# Altium project IDC_MCX_Adapter.PrjPCB
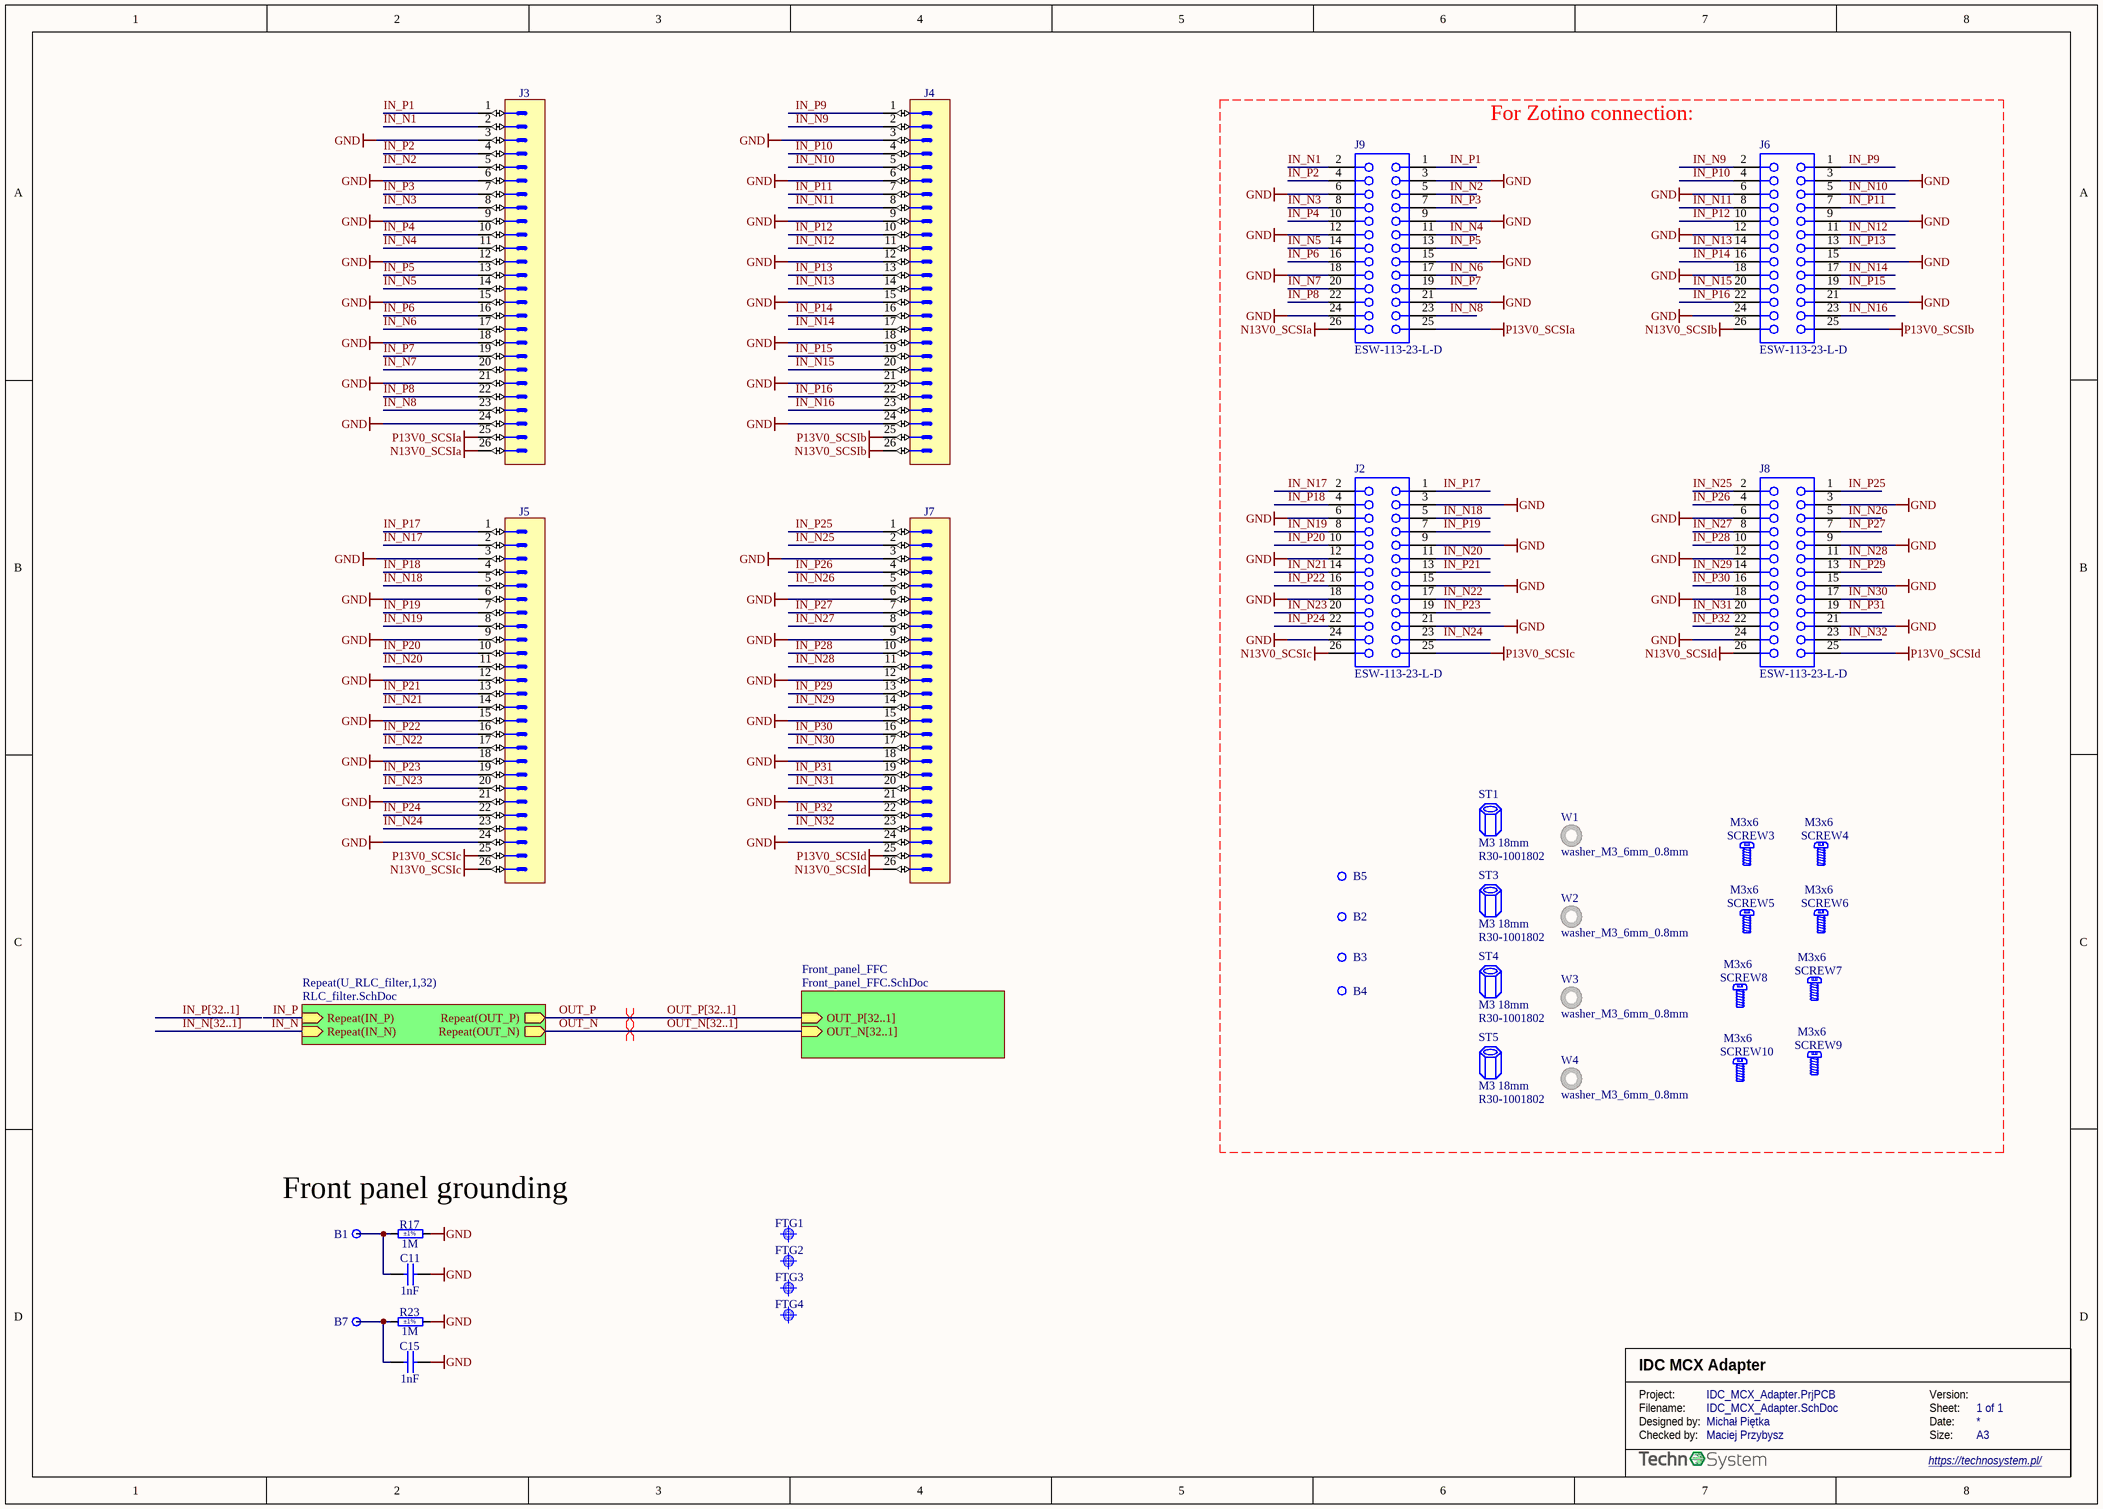
[diagram p0: IDC_MCX_Adapter.SchDoc]
P_version: 2.0
3 sheets, 264 parts. Net scope: hierarchical (ports join the sheet entries above them; power ports are global).
Board file: IDC_MCX_Adapter.PCBDOC
Sheets:
  IDC_MCX_Adapter.SchDoc
    U_RLC_filter1 = RLC_filter.SchDoc
    U_RLC_filter2 = RLC_filter.SchDoc
    U_RLC_filter3 = RLC_filter.SchDoc
    U_RLC_filter4 = RLC_filter.SchDoc
    U_RLC_filter5 = RLC_filter.SchDoc
    U_RLC_filter6 = RLC_filter.SchDoc
    U_RLC_filter7 = RLC_filter.SchDoc
    U_RLC_filter8 = RLC_filter.SchDoc
    U_RLC_filter9 = RLC_filter.SchDoc
    U_RLC_filter10 = RLC_filter.SchDoc
    U_RLC_filter11 = RLC_filter.SchDoc
    U_RLC_filter12 = RLC_filter.SchDoc
    U_RLC_filter13 = RLC_filter.SchDoc
    U_RLC_filter14 = RLC_filter.SchDoc
    U_RLC_filter15 = RLC_filter.SchDoc
    U_RLC_filter16 = RLC_filter.SchDoc
    U_RLC_filter17 = RLC_filter.SchDoc
    U_RLC_filter18 = RLC_filter.SchDoc
    U_RLC_filter19 = RLC_filter.SchDoc
    U_RLC_filter20 = RLC_filter.SchDoc
    U_RLC_filter21 = RLC_filter.SchDoc
    U_RLC_filter22 = RLC_filter.SchDoc
    U_RLC_filter23 = RLC_filter.SchDoc
    U_RLC_filter24 = RLC_filter.SchDoc
    U_RLC_filter25 = RLC_filter.SchDoc
    U_RLC_filter26 = RLC_filter.SchDoc
    U_RLC_filter27 = RLC_filter.SchDoc
    U_RLC_filter28 = RLC_filter.SchDoc
    U_RLC_filter29 = RLC_filter.SchDoc
    U_RLC_filter30 = RLC_filter.SchDoc
    U_RLC_filter31 = RLC_filter.SchDoc
    U_RLC_filter32 = RLC_filter.SchDoc
    Front_panel_FFC = Front_panel_FFC.SchDoc

## Sheet IDC_MCX_Adapter.SchDoc: IDC MCX Adapter
size A3; CheckedBy: Maciej Przybysz; Author: Michał Piętka; Organization: Technosystem; Address1: Słoneczna 125, 05-506 Kolonia Lesznowola; Address2: https://technosystem.pl/; Address4: (NOT USED); DocumentNumber: 1; Revision: 0; SheetNumber: 1; SheetTotal: 1; Version: 2.0

### Parts
B1  Plated Hole  [MTG270_500]  (value not drawn)  (no BOM)
B2  Plated Hole  [MTG320_700]  (value not drawn)  (no BOM)
B3  Plated Hole  [MTG320_700]  (value not drawn)  (no BOM)
B4  Plated Hole  [MTG320_700]  (value not drawn)  (no BOM)
B5  Plated Hole  [MTG320_700]  (value not drawn)  (no BOM)
B7  Plated Hole  [MTG270_500]  (value not drawn)  (no BOM)
C11  1nF  [CAPC1608X87N]
C15  1nF  [CAPC1608X87N]
FTG1  Use only in PCB  [FIDUCIAL_TOP_C100-200]  (value not drawn)
FTG2  Use only in PCB  [FIDUCIAL_TOP_S100-200]  (value not drawn)
FTG3  Use only in PCB  [FIDUCIAL_TOP_S100-200]  (value not drawn)
FTG4  Use only in PCB  [FIDUCIAL_TOP_S100-200]  (value not drawn)
J2  ESW-113-23-L-D  [SMTC-ESW-113-23-X-D]
J3  Header 26  [3M_N2526-6002RB]  (value not drawn)
J4  Header 26  [3M_N2526-6002RB]  (value not drawn)
J5  Header 26  [3M_N2526-6002RB]  (value not drawn)
J6  ESW-113-23-L-D  [SMTC-ESW-113-23-X-D]
J7  Header 26  [3M_N2526-6002RB]  (value not drawn)
J8  ESW-113-23-L-D  [SMTC-ESW-113-23-X-D]
J9  ESW-113-23-L-D  [SMTC-ESW-113-23-X-D]
R17  1M  Tolerance: ±1%  [RESC1608X55N]
R23  1M  Tolerance: ±1%  [RESC1608X55N]
SCREW3  M3x6  [BOSSARD_BN5687-3061605_v]
SCREW4  M3x6  [BOSSARD_BN5687-3061605_v]
SCREW5  M3x6  [BOSSARD_BN5687-3061605_v]
SCREW6  M3x6  [BOSSARD_BN5687-3061605_v]
SCREW7  M3x6  [BOSSARD_BN5687-3061605_v]
SCREW8  M3x6  [BOSSARD_BN5687-3061605_v]
SCREW9  M3x6  [BOSSARD_BN5687-3061605_v]
SCREW10  M3x6  [BOSSARD_BN5687-3061605_v]
ST1  M3 18mm  [R30-1001802]
ST3  M3 18mm  [R30-1001802]
ST4  M3 18mm  [R30-1001802]
ST5  M3 18mm  [R30-1001802]
W1  washer_M3_6mm_0.8mm  [washer_M3_6mm_0.8mm]
W2  washer_M3_6mm_0.8mm  [washer_M3_6mm_0.8mm]
W3  washer_M3_6mm_0.8mm  [washer_M3_6mm_0.8mm]
W4  washer_M3_6mm_0.8mm  [washer_M3_6mm_0.8mm]

### Sub-sheets
Front_panel_FFC = Front_panel_FFC.SchDoc: OUT_P[32..1] (in), OUT_N[32..1] (in)
Repeat(U_RLC_filter,1,32) = RLC_filter.SchDoc: Repeat(IN_P) (in), Repeat(IN_N) (in), Repeat(OUT_P) (out), Repeat(OUT_N) (out)

### Nets
GND: C11.2 C15.2 J2.3 J2.6 J2.9 J2.12 J2.15 J2.18 J2.21 J2.24 J3.3 J3.6 J3.9 J3.12 J3.15 J3.18 J3.21 J3.24 J4.3 J4.6 J4.9 J4.12 J4.15 J4.18 J4.21 J4.24 J5.3 J5.6 J5.9 J5.12 J5.15 J5.18 J5.21 J5.24 J6.3 J6.6 J6.9 J6.12 J6.15 J6.18 J6.21 J6.24 J7.3 J7.6 J7.9 J7.12 J7.15 J7.18 J7.21 J7.24 J8.3 J8.6 J8.9 J8.12 J8.15 J8.18 J8.21 J8.24 J9.3 J9.6 J9.9 J9.12 J9.15 J9.18 J9.21 J9.24 R17.2 R23.2
N13V0_SCSIa: J3.26 J9.26
N13V0_SCSIb: J4.26 J6.26
N13V0_SCSIc: J2.26 J5.26
N13V0_SCSId: J7.26 J8.26
P13V0_SCSIa: J3.25 J9.25
P13V0_SCSIb: J4.25 J6.25
P13V0_SCSIc: J2.25 J5.25
P13V0_SCSId: J7.25 J8.25
IN_N: sheet Repeat(U_RLC_filter,1,32)/Repeat(IN_N)
IN_N1: J3.2 J9.2  [project net IN_N]
IN_N2: J3.5 J9.5  [project net IN_N]
IN_N3: J3.8 J9.8  [project net IN_N]
IN_N4: J3.11 J9.11  [project net IN_N]
IN_N5: J3.14 J9.14  [project net IN_N]
IN_N6: J3.17 J9.17  [project net IN_N]
IN_N7: J3.20 J9.20  [project net IN_N]
IN_N8: J3.23 J9.23  [project net IN_N]
IN_N9: J4.2 J6.2  [project net IN_N]
IN_N10: J4.5 J6.5  [project net IN_N]
IN_N11: J4.8 J6.8  [project net IN_N]
IN_N12: J4.11 J6.11  [project net IN_N]
IN_N13: J4.14 J6.14  [project net IN_N]
IN_N14: J4.17 J6.17  [project net IN_N]
IN_N15: J4.20 J6.20  [project net IN_N]
IN_N16: J4.23 J6.23  [project net IN_N]
IN_N17: J2.2 J5.2  [project net IN_N]
IN_N18: J2.5 J5.5  [project net IN_N]
IN_N19: J2.8 J5.8  [project net IN_N]
IN_N20: J2.11 J5.11  [project net IN_N]
IN_N21: J2.14 J5.14  [project net IN_N]
IN_N22: J2.17 J5.17  [project net IN_N]
IN_N23: J2.20 J5.20  [project net IN_N]
IN_N24: J2.23 J5.23  [project net IN_N]
IN_N25: J7.2 J8.2  [project net IN_N]
IN_N26: J7.5 J8.5  [project net IN_N]
IN_N27: J7.8 J8.8  [project net IN_N]
IN_N28: J7.11 J8.11  [project net IN_N]
IN_N29: J7.14 J8.14  [project net IN_N]
IN_N30: J7.17 J8.17  [project net IN_N]
IN_N31: J7.20 J8.20  [project net IN_N]
IN_N32: J7.23 J8.23  [project net IN_N]
IN_P: sheet Repeat(U_RLC_filter,1,32)/Repeat(IN_P)
IN_P1: J3.1 J9.1  [project net IN_P]
IN_P2: J3.4 J9.4  [project net IN_P]
IN_P3: J3.7 J9.7  [project net IN_P]
IN_P4: J3.10 J9.10  [project net IN_P]
IN_P5: J3.13 J9.13  [project net IN_P]
IN_P6: J3.16 J9.16  [project net IN_P]
IN_P7: J3.19 J9.19  [project net IN_P]
IN_P8: J3.22 J9.22  [project net IN_P]
IN_P9: J4.1 J6.1  [project net IN_P]
IN_P10: J4.4 J6.4  [project net IN_P]
IN_P11: J4.7 J6.7  [project net IN_P]
IN_P12: J4.10 J6.10  [project net IN_P]
IN_P13: J4.13 J6.13  [project net IN_P]
IN_P14: J4.16 J6.16  [project net IN_P]
IN_P15: J4.19 J6.19  [project net IN_P]
IN_P16: J4.22 J6.22  [project net IN_P]
IN_P17: J2.1 J5.1  [project net IN_P]
IN_P18: J2.4 J5.4  [project net IN_P]
IN_P19: J2.7 J5.7  [project net IN_P]
IN_P20: J2.10 J5.10  [project net IN_P]
IN_P21: J2.13 J5.13  [project net IN_P]
IN_P22: J2.16 J5.16  [project net IN_P]
IN_P23: J2.19 J5.19  [project net IN_P]
IN_P24: J2.22 J5.22  [project net IN_P]
IN_P25: J7.1 J8.1  [project net IN_P]
IN_P26: J7.4 J8.4  [project net IN_P]
IN_P27: J7.7 J8.7  [project net IN_P]
IN_P28: J7.10 J8.10  [project net IN_P]
IN_P29: J7.13 J8.13  [project net IN_P]
IN_P30: J7.16 J8.16  [project net IN_P]
IN_P31: J7.19 J8.19  [project net IN_P]
IN_P32: J7.22 J8.22  [project net IN_P]
OUT_N: sheet Repeat(U_RLC_filter,1,32)/Repeat(OUT_N)
OUT_P: sheet Repeat(U_RLC_filter,1,32)/Repeat(OUT_P)
NetB1_1: B1.1 C11.1 R17.1
NetB7_1: B7.1 C15.1 R23.1

Not connected (* = marked no-connect by the designer): B2 1; B3 1; B4 1; B5 1

### Buses and harness runs
bus IN_N[32..1]
bus IN_P[32..1]
bus OUT_N[32..1] = sheet Front_panel_FFC/OUT_N[32..1]
bus OUT_P[32..1] = sheet Front_panel_FFC/OUT_P[32..1]

### Layout directives
differential pair: OUT_N, OUT_P

### Notes on the sheet
- (near J6) For Zotino connection:
- Front panel grounding
- Project:
- Version:
- Designed by:
- Checked by:
- Filename:
- Size:
- Date:
- Sheet:
- A3

### Library data of the parts
B1 B7 = PLATED_HOLE2.7_PAD5.0: Single Terminal Socket; Part Description: Plated Through Hole: Hole Dia.=2.7mm Pad Dia.=5.0mm; Mounted: No; Part Number: PLATED_HOLE2.7_PAD5.0; Component Type: Standard (No BOM); Pin Count: 1; Family: Plated Hole; Socket: No; SMD: No; Sense: No; Status: None; ComponentHeight: 0mm; HelpURL: Undefined; Author: CERN DEM JMW; CreateDate: 27.09.2011; LatestRevisionDate: 27.09.2011; PackageDescription: Plated Through Hole: Hole Dia.=2.7mm Pad Dia.=5.0mm
B2-B5 = PLATED_HOLE3.2_PAD7.0: Single Terminal Socket; Part Description: Plated Through Hole: Hole Dia.=3.2mm Pad Dia.=7.0mm; Mounted: No; Part Number: PLATED_HOLE3.2_PAD7.0; Component Type: Standard (No BOM); Pin Count: 1; Family: Plated Hole; Socket: No; SMD: No; Sense: No; Status: None; ComponentHeight: 0mm; HelpURL: Undefined; Author: CERN DEM JMW; CreateDate: 28.11.2017; LatestRevisionDate: 28.11.2017; PackageDescription: Plated Through Hole: Hole Dia.=3.2mm Pad Dia.=7.0mm
C11 C15 = CC0603_1NF_50V_10%_X7R: Non-polarised capacitor; Part Description: SMD Multilayer Chip Ceramic Capacitor; Manufacturer: GENERIC; Manufacturer1 Part Number: 223858615623; Voltage: 50V; TC: X7R; Tolerance: ±10%; Part Number: CC0603_1NF_50V_10%_X7R; Component Kind: Standard; Component Type: Standard; Pin Count: 2; Value: 1nF; Status: Preferred; Manufacturer Part Number: CC0603_1NF_50V_10%_X7R; Case: 0603; Mounted: Yes; Socket: No; SMD: Yes; Sense: No; Manufacturer1 ComponentHeight: 0.87mm; HelpURL: \\cern.ch\dfs\Applications\Altium\Datasheets\CC0603_X7R_PHYCOMP.pdf; Author: CERN DEM JLC; CreateDate: 03.12.2007; LatestRevisionDate: 03.12.2007; Manufacturer1 Example: PHYCOMP
FTG1 = FIDUCIAL_TARGET_C100-200: Fiducial Target; Part Description: Round Fiducial Target, Top Layer, 1.0mm, Top Solder 2.0mm, Keepout =2.0mm; Mounted: No; Part Number: FIDUCIAL_TARGET_C100-200; Component Kind: Standard (No BOM); Component Type: Standard (No BOM); Pin Count: 1; Family: Fiducial; Socket: No; SMD: Yes; Sense: No; Status: None; ComponentHeight: 0mm; HelpURL: Undefined; Author: CERN DEM JLC; CreateDate: 09.02.2010; LatestRevisionDate: 04.04.2012; PackageDescription: Round Fiducial Target, Top Layer, 1.0mm, Top Solder 2.0mm, Keepout =2.0mm
FTG2-FTG4 = FIDUCIAL_TARGET_S100-200: Fiducial Target; Part Description: Square Fiducial Target, Top Layer, 1.0mm, Top Solder 2.0mm, Keepout =2.0mm; Mounted: No; Part Number: FIDUCIAL_TARGET_S100-200; Component Kind: Standard (No BOM); Component Type: Standard (No BOM); Pin Count: 1; Family: Fiducial; Socket: No; SMD: Yes; Sense: No; Status: None; ComponentHeight: 0mm; HelpURL: Undefined; Author: CERN DEM JLC; CreateDate: 09.02.2010; LatestRevisionDate: 04.04.2012; PackageDescription: Square Fiducial Target, Top Layer, 1.0mm, Top Solder 2.0mm, Keepout =2.0mm
J2 J6 J8 J9 = CMP-1023-00053-1: Elevated Socket, Through-hole, Vertical, -55 to 125 degC, 2.54 mm Pitch, 26-Pin, Female, RoHS; Manufacturer: Samtec; Pitch: 2.54 mm; PartNumber: ESW-113-23-L-D; Orientation: Vertical; PackageReference: ESW-113-23-X-D; ComponentLink3Description: Package Specification; Temperature Range: -55 to 125 degC; PackageDescription: ESW Strip ASM; RoHS: True; ComponentLink1Description: Manufacturer URL; Mounting Technology: Through-hole; ComponentLink2Description: Datasheet; ComponentLink3URL: http://www.samtec.com/documents/webfiles/cpdf/ESW-1XX-XX-X-X-XX-XX-MKT.pdf; PackageVersion: AV, 7/1985; ComponentLink1URL: http://www.samtec.com; ComponentLink2URL: http://www.samtec.com/documents/webfiles/pdf/ESW_TH.PDF; DatasheetVersion: F-214
J3-J5 J7 = 3M_N2526-6002RB: Connector 26 Male; Part Description: 26 Contacts - Straight .100'' x .100'' Low Profile Four-Wall Header, 2500 Series; Manufacturer: 3M; PressFit: No; Part Number: 3M_N2526-6002RB; Component Kind: Standard; Component Type: Standard; Pin Count: 26; Family: Header 26; Mounted: Yes; Socket: No; SMD: No; Sense: No; Status: None; Manufacturer Part Number: N2526-6002RB; ComponentHeight: 10.03mm; HelpURL: \\cern.ch\dfs\Applications\Altium\Datasheets\3M_N2526-6002RB.pdf; Author: CERN DEM JLC; CreateDate: 11.02.2009; LatestRevisionDate: 11.08.2009
R17 R23 = R0603_1M_1%_0.1W_100PPM: Resistor - 1%; Part Description: General Purpose Thick Film Chip Resistor; Manufacturer: GENERIC; Manufacturer1 Part Number: NRC06F1004TRF; PressFit: No; Power: 0.1W; TC: ±100ppm/°C; Part Number: R0603_1M_1%_0.1W_100PPM; Component Kind: Standard; Component Type: Standard; Pin Count: 2; Value: 1M; Status: Preferred; Manufacturer Part Number: R0603_1M_1%_0.1W_100PPM; Case: 0603; Mounted: Yes; Sense: No; Socket: No; SMD: Yes; Manufacturer1 Example: NIC COMPONENT; Manufacturer1 ComponentHeight: 0.55mm; HelpURL: \\cern.ch\dfs\Applications\Altium\Datasheets\R0603_NIC_NRC.pdf; Author: CERN DEM JLC; CreateDate: 03.12.2007; LatestRevisionDate: 13.03.2008
SCREW3-SCREW10 = BOSSARD_BN5687-3061605_v: Screw; Part Description: M3 L=6mm Hexalobular Socket Pan Head Screw, Fully Threaded, Stainless Steel A2; Manufacturer Part Number: BN5687 Art.3061605; PressFit: No; Part Number: BOSSARD_BN5687-3061605_v; Component Kind: Standard; Component Type: Mechanical; Pin Count: 0; PackageDescription: M3 L=6mm Hexalobular Socket Pan Head Screw, Fully Threaded - Stainless Steel A2; Mounted: Yes; Socket: No; SMD: No; Sense: No; Status: None; Value: M3x6; Manufacturer: BOSSARD; ComponentHeight: 2.4mm; HelpURL: \\cern.ch\dfs\Applications\Altium\Datasheets\BOSSARD_BN5687-3061605.pdf; Author: CERN DEM JLC; CreateDate: 15.01.2013; LatestRevisionDate: 15.01.2013
ST1 ST3-ST5 = STANDOFF_HARWIN_R30_1001802: M3.0x18 standoff; Manufacturer: Harwin; Manufacturer Part Number: R30-1001802
W1-W4 = washer_M3_6mm_0.8mm: M3 Washer: / ID: 3.2mm / OD: 6mm / Thickness 0.8mm; Manufacturer: Accu Limited; Manufacturer Part Number: HAFZ-M3-A4

## Sheet RLC_filter.SchDoc: RLC filter
size A4; EDA_Number: ARTIQ; Projet: Fastino; ModifiedBy: -; CheckedDate: -; DivGrp: WUT ISE; Designer: G.Kasprowicz; CheckedBy: Maciej Przybysz; Author: Michał Piętka; Organization: Technosystem; Address1: Słoneczna 125, 05-506 Kolonia Lesznowola; Address2: https://technosystem.pl/; Address4: (NOT USED); DocumentNumber: 1; Revision: 0; SheetNumber: 1; SheetTotal: 1; Version: 2.0
Used 32 times, as channels U_RLC_filter1, U_RLC_filter2, U_RLC_filter3, U_RLC_filter4, U_RLC_filter5, U_RLC_filter6, U_RLC_filter7, U_RLC_filter8, U_RLC_filter9, U_RLC_filter10, U_RLC_filter11, U_RLC_filter12, U_RLC_filter13, U_RLC_filter14, U_RLC_filter15, U_RLC_filter16, U_RLC_filter17, U_RLC_filter18, U_RLC_filter19, U_RLC_filter20, U_RLC_filter21, U_RLC_filter22, U_RLC_filter23, U_RLC_filter24, U_RLC_filter25, U_RLC_filter26, U_RLC_filter27, U_RLC_filter28, U_RLC_filter29, U_RLC_filter30, U_RLC_filter31, U_RLC_filter32. Parts and nets are listed once, with the designators drawn on the sheet.
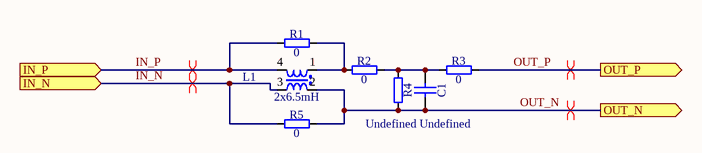
[diagram p1: RLC_filter.SchDoc]

### Parts
C1  Undefined  [CAPC2012X135N]
L1  2x6.5mH  [IND_WURTH_WE-SL2]
R1  0  [RESC1608X55N]
R2  0  [RESC1608X55N]
R3  0  [RESC1608X55N]
R4  Undefined  [RESC1608X55N]
R5  0  [RESC1608X55N]

### Ports
IN_N (in), IN_P (in), OUT_N (out), OUT_P (out)

### Nets
IN_N: L1.3 R5.2 ; port IN_N
IN_P: L1.4 R1.2 ; port IN_P
OUT_N: C1.1 L1.2 R4.1 R5.1 ; port OUT_N
OUT_P: R3.1 ; port OUT_P
NetC1_2: C1.2 R2.1 R3.2 R4.2
NetL1_1: L1.1 R1.1 R2.2

### Channels
U_RLC_filter1: designators end in _1; ports IN_N=IN_N IN_P=IN_P OUT_N=OUT_N OUT_P=OUT_P
U_RLC_filter2: designators end in _2; ports IN_N=IN_N IN_P=IN_P OUT_N=OUT_N OUT_P=OUT_P
U_RLC_filter3: designators end in _3; ports IN_N=IN_N IN_P=IN_P OUT_N=OUT_N OUT_P=OUT_P
U_RLC_filter4: designators end in _4; ports IN_N=IN_N IN_P=IN_P OUT_N=OUT_N OUT_P=OUT_P
U_RLC_filter5: designators end in _5; ports IN_N=IN_N IN_P=IN_P OUT_N=OUT_N OUT_P=OUT_P
U_RLC_filter6: designators end in _6; ports IN_N=IN_N IN_P=IN_P OUT_N=OUT_N OUT_P=OUT_P
U_RLC_filter7: designators end in _7; ports IN_N=IN_N IN_P=IN_P OUT_N=OUT_N OUT_P=OUT_P
U_RLC_filter8: designators end in _8; ports IN_N=IN_N IN_P=IN_P OUT_N=OUT_N OUT_P=OUT_P
U_RLC_filter9: designators end in _9; ports IN_N=IN_N IN_P=IN_P OUT_N=OUT_N OUT_P=OUT_P
U_RLC_filter10: designators end in _10; ports IN_N=IN_N IN_P=IN_P OUT_N=OUT_N OUT_P=OUT_P
U_RLC_filter11: designators end in _11; ports IN_N=IN_N IN_P=IN_P OUT_N=OUT_N OUT_P=OUT_P
U_RLC_filter12: designators end in _12; ports IN_N=IN_N IN_P=IN_P OUT_N=OUT_N OUT_P=OUT_P
U_RLC_filter13: designators end in _13; ports IN_N=IN_N IN_P=IN_P OUT_N=OUT_N OUT_P=OUT_P
U_RLC_filter14: designators end in _14; ports IN_N=IN_N IN_P=IN_P OUT_N=OUT_N OUT_P=OUT_P
U_RLC_filter15: designators end in _15; ports IN_N=IN_N IN_P=IN_P OUT_N=OUT_N OUT_P=OUT_P
U_RLC_filter16: designators end in _16; ports IN_N=IN_N IN_P=IN_P OUT_N=OUT_N OUT_P=OUT_P
U_RLC_filter17: designators end in _17; ports IN_N=IN_N IN_P=IN_P OUT_N=OUT_N OUT_P=OUT_P
U_RLC_filter18: designators end in _18; ports IN_N=IN_N IN_P=IN_P OUT_N=OUT_N OUT_P=OUT_P
U_RLC_filter19: designators end in _19; ports IN_N=IN_N IN_P=IN_P OUT_N=OUT_N OUT_P=OUT_P
U_RLC_filter20: designators end in _20; ports IN_N=IN_N IN_P=IN_P OUT_N=OUT_N OUT_P=OUT_P
U_RLC_filter21: designators end in _21; ports IN_N=IN_N IN_P=IN_P OUT_N=OUT_N OUT_P=OUT_P
U_RLC_filter22: designators end in _22; ports IN_N=IN_N IN_P=IN_P OUT_N=OUT_N OUT_P=OUT_P
U_RLC_filter23: designators end in _23; ports IN_N=IN_N IN_P=IN_P OUT_N=OUT_N OUT_P=OUT_P
U_RLC_filter24: designators end in _24; ports IN_N=IN_N IN_P=IN_P OUT_N=OUT_N OUT_P=OUT_P
U_RLC_filter25: designators end in _25; ports IN_N=IN_N IN_P=IN_P OUT_N=OUT_N OUT_P=OUT_P
U_RLC_filter26: designators end in _26; ports IN_N=IN_N IN_P=IN_P OUT_N=OUT_N OUT_P=OUT_P
U_RLC_filter27: designators end in _27; ports IN_N=IN_N IN_P=IN_P OUT_N=OUT_N OUT_P=OUT_P
U_RLC_filter28: designators end in _28; ports IN_N=IN_N IN_P=IN_P OUT_N=OUT_N OUT_P=OUT_P
U_RLC_filter29: designators end in _29; ports IN_N=IN_N IN_P=IN_P OUT_N=OUT_N OUT_P=OUT_P
U_RLC_filter30: designators end in _30; ports IN_N=IN_N IN_P=IN_P OUT_N=OUT_N OUT_P=OUT_P
U_RLC_filter31: designators end in _31; ports IN_N=IN_N IN_P=IN_P OUT_N=OUT_N OUT_P=OUT_P
U_RLC_filter32: designators end in _32; ports IN_N=IN_N IN_P=IN_P OUT_N=OUT_N OUT_P=OUT_P

### Layout directives
differential pair: IN_N, IN_P, OUT_N, OUT_P

### Notes on the sheet
- Project:
- Version:
- Designed by:
- Checked by:
- Filename:
- Size:
- Date:
- Sheet:
- A4

### Library data of the parts
C1 = CC0805_NO-VALUE: Non-polarised capacitor; Part Description: Reserved Footprint For 0805(2012) Chip Ceramic Capacitor; Mounted: No; Part Number: CC0805_NO-VALUE; Component Kind: Standard; Component Type: Standard; Pin Count: 2; Value: Undefined; Status: None; Manufacturer: Undefined; Manufacturer Part Number: CC0805_NO-VALUE; Case: 0805; Socket: No; SMD: Yes; Sense: No; Manufacturer1 ComponentHeight: 1.35mm; HelpURL: Undefined; Author: CERN DEM JLC; CreateDate: 10.12.2008; LatestRevisionDate: 11.09.2013
L1 = IND_6.5MH_50%_WURTH_WE-SL2-744229: Inductor Common Mode; Part Description: Common Mode SMD Line Filter (WE-SL2 Serie); Manufacturer: WURTH ELEKTRONIK; Manufacturer Part Number: 744229; Power: 400mA; Resistance: 0.95R; Tolerance: ±50%; Part Number: IND_6.5MH_50%_WURTH_WE-SL2-744229; Component Kind: Standard; Component Type: Standard; Pin Count: 4; Value: 2x6.5mH; Status: None; Mounted: Yes; Socket: No; SMD: Yes; Sense: No; ComponentHeight: 5.3mm; HelpURL: \\cern.ch\dfs\Applications\Altium\Datasheets\IND_WURTH_WE-SL2_744229.pdf; Author: CERN DEM JLC; CreateDate: 01.10.2012; LatestRevisionDate: 15.10.2012
R1-R3 R5 = R0603_0R_JUMPER: Resistor; Part Description: 1A (0.05R Max DC Resistance) Zero Ohm Jumper; Manufacturer: GENERIC; Manufacturer1 Part Number: NRC06Z0; Part Number: R0603_0R_JUMPER; Component Kind: Standard; Component Type: Standard; Pin Count: 2; Value: 0; Status: Preferred; Manufacturer Part Number: R0603_0R_JUMPER; Case: 0603; Mounted: Yes; Sense: No; Socket: No; SMD: Yes; Manufacturer1 Example: NIC COMPONENT; Manufacturer1 ComponentHeight: 0.55mm; HelpURL: \\cern.ch\dfs\Applications\Altium\Datasheets\R0603_NIC_NRC.pdf; Author: CERN DEM JLC; CreateDate: 03.12.2007; LatestRevisionDate: 13.03.2008
R4 = R0603_NO-VALUE: Resistor; Part Description: Reserved Footprint For a 0603 (1608) Chip Resistor; PressFit: No; Mounted: No; Part Number: R0603_NO-VALUE; Component Kind: Standard; Component Type: Standard; Pin Count: 2; Value: Undefined; Status: None; Manufacturer: Undefined; Manufacturer Part Number: R0603_NO-VALUE; Case: 0603; Sense: No; Socket: No; SMD: Yes; Manufacturer1 Example: Undefined; Manufacturer1 Part Number: Undefined; Manufacturer1 ComponentHeight: Undefined; HelpURL: Undefined; Author: CERN DEM JLC; CreateDate: 03.12.2007; LatestRevisionDate: 13.03.2008

## Sheet Front_panel_FFC.SchDoc: Front panel FFC connector
size A4; EDA_Number: ARTIQ; Projet: Fastino; CheckedBy: Maciej Przybysz; Author: Michał Piętka; Organization: Technosystem; Address1: Słoneczna 125, 05-506 Kolonia Lesznowola; Address2: https://technosystem.pl/; Address4: (NOT USED); DocumentNumber: 1; Revision: 0; SheetNumber: 1; SheetTotal: 1; Version: 2.0
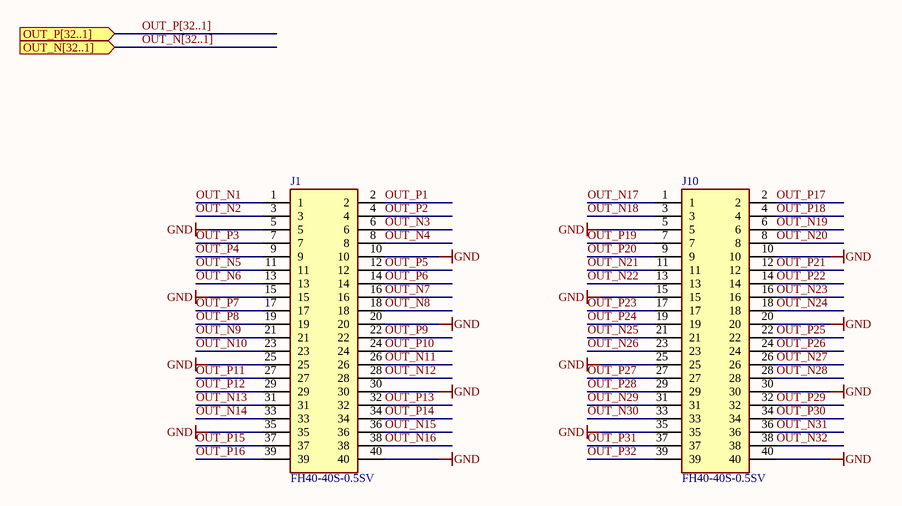
[diagram p2: Front_panel_FFC.SchDoc]

### Parts
J1  FH40-40S-0.5SV  [FH4040S05SV]
J10  FH40-40S-0.5SV  [FH4040S05SV]

### Ports
OUT_N[32..1] (in), OUT_P[32..1] (in)

### Nets
GND: J1.5 J1.10 J1.15 J1.20 J1.25 J1.30 J1.35 J1.40 J10.5 J10.10 J10.15 J10.20 J10.25 J10.30 J10.35 J10.40
OUT_N1: J1.1  [project net OUT_N]
OUT_N2: J1.3  [project net OUT_N]
OUT_N3: J1.6  [project net OUT_N]
OUT_N4: J1.8  [project net OUT_N]
OUT_N5: J1.11  [project net OUT_N]
OUT_N6: J1.13  [project net OUT_N]
OUT_N7: J1.16  [project net OUT_N]
OUT_N8: J1.18  [project net OUT_N]
OUT_N9: J1.21  [project net OUT_N]
OUT_N10: J1.23  [project net OUT_N]
OUT_N11: J1.26  [project net OUT_N]
OUT_N12: J1.28  [project net OUT_N]
OUT_N13: J1.31  [project net OUT_N]
OUT_N14: J1.33  [project net OUT_N]
OUT_N15: J1.36  [project net OUT_N]
OUT_N16: J1.38  [project net OUT_N]
OUT_N17: J10.1  [project net OUT_N]
OUT_N18: J10.3  [project net OUT_N]
OUT_N19: J10.6  [project net OUT_N]
OUT_N20: J10.8  [project net OUT_N]
OUT_N21: J10.11  [project net OUT_N]
OUT_N22: J10.13  [project net OUT_N]
OUT_N23: J10.16  [project net OUT_N]
OUT_N24: J10.18  [project net OUT_N]
OUT_N25: J10.21  [project net OUT_N]
OUT_N26: J10.23  [project net OUT_N]
OUT_N27: J10.26  [project net OUT_N]
OUT_N28: J10.28  [project net OUT_N]
OUT_N29: J10.31  [project net OUT_N]
OUT_N30: J10.33  [project net OUT_N]
OUT_N31: J10.36  [project net OUT_N]
OUT_N32: J10.38  [project net OUT_N]
OUT_P1: J1.2  [project net OUT_P]
OUT_P2: J1.4  [project net OUT_P]
OUT_P3: J1.7  [project net OUT_P]
OUT_P4: J1.9  [project net OUT_P]
OUT_P5: J1.12  [project net OUT_P]
OUT_P6: J1.14  [project net OUT_P]
OUT_P7: J1.17  [project net OUT_P]
OUT_P8: J1.19  [project net OUT_P]
OUT_P9: J1.22  [project net OUT_P]
OUT_P10: J1.24  [project net OUT_P]
OUT_P11: J1.27  [project net OUT_P]
OUT_P12: J1.29  [project net OUT_P]
OUT_P13: J1.32  [project net OUT_P]
OUT_P14: J1.34  [project net OUT_P]
OUT_P15: J1.37  [project net OUT_P]
OUT_P16: J1.39  [project net OUT_P]
OUT_P17: J10.2  [project net OUT_P]
OUT_P18: J10.4  [project net OUT_P]
OUT_P19: J10.7  [project net OUT_P]
OUT_P20: J10.9  [project net OUT_P]
OUT_P21: J10.12  [project net OUT_P]
OUT_P22: J10.14  [project net OUT_P]
OUT_P23: J10.17  [project net OUT_P]
OUT_P24: J10.19  [project net OUT_P]
OUT_P25: J10.22  [project net OUT_P]
OUT_P26: J10.24  [project net OUT_P]
OUT_P27: J10.27  [project net OUT_P]
OUT_P28: J10.29  [project net OUT_P]
OUT_P29: J10.32  [project net OUT_P]
OUT_P30: J10.34  [project net OUT_P]
OUT_P31: J10.37  [project net OUT_P]
OUT_P32: J10.39  [project net OUT_P]

### Buses and harness runs
bus OUT_N[32..1] = port OUT_N[32..1]
bus OUT_P[32..1] = port OUT_P[32..1]

### Notes on the sheet
- Project:
- Version:
- Designed by:
- Checked by:
- Filename:
- Size:
- Date:
- Sheet:
- A4

### Library data of the parts
J1 J10 = FH40-40S-0.5SV: Connector; Manufacturer_Name: Hirose; Part Number: 798-FH40-40S-0.5SV; Datasheet Link: https://datasheet.datasheetarchive.com/originals/distributors/Datasheets-DGA16/847294.pdf; Height: 6mm; Mouser Part Number: 798-FH40-40S-0.5SV; Mouser Price/Stock: https://www.mouser.co.uk/ProductDetail/Hirose-Connector/FH40-40S-05SV/?qs=Y%252Ba6yYk543mLwEJVPI7oow%3D%3D; Manufacturer Part Number: FH40-40S-0.5SV

## Nets that join several sheets
GND: IDC_MCX_Adapter (68 pins), Front_panel_FFC (16 pins)
IN_N: IDC_MCX_Adapter (J3.2 J9.2), U_RLC_filter1 (L1_1.3 R5_1.2)
IN_N: IDC_MCX_Adapter (J3.5 J9.5), U_RLC_filter2 (L1_2.3 R5_2.2)
IN_N: IDC_MCX_Adapter (J3.8 J9.8), U_RLC_filter3 (L1_3.3 R5_3.2)
IN_N: IDC_MCX_Adapter (J3.11 J9.11), U_RLC_filter4 (L1_4.3 R5_4.2)
IN_N: IDC_MCX_Adapter (J3.14 J9.14), U_RLC_filter5 (L1_5.3 R5_5.2)
IN_N: IDC_MCX_Adapter (J3.17 J9.17), U_RLC_filter6 (L1_6.3 R5_6.2)
IN_N: IDC_MCX_Adapter (J3.20 J9.20), U_RLC_filter7 (L1_7.3 R5_7.2)
IN_N: IDC_MCX_Adapter (J3.23 J9.23), U_RLC_filter8 (L1_8.3 R5_8.2)
IN_N: IDC_MCX_Adapter (J4.2 J6.2), U_RLC_filter9 (L1_9.3 R5_9.2)
IN_N: IDC_MCX_Adapter (J4.5 J6.5), U_RLC_filter10 (L1_10.3 R5_10.2)
IN_N: IDC_MCX_Adapter (J4.8 J6.8), U_RLC_filter11 (L1_11.3 R5_11.2)
IN_N: IDC_MCX_Adapter (J4.11 J6.11), U_RLC_filter12 (L1_12.3 R5_12.2)
IN_N: IDC_MCX_Adapter (J4.14 J6.14), U_RLC_filter13 (L1_13.3 R5_13.2)
IN_N: IDC_MCX_Adapter (J4.17 J6.17), U_RLC_filter14 (L1_14.3 R5_14.2)
IN_N: IDC_MCX_Adapter (J4.20 J6.20), U_RLC_filter15 (L1_15.3 R5_15.2)
IN_N: IDC_MCX_Adapter (J4.23 J6.23), U_RLC_filter16 (L1_16.3 R5_16.2)
IN_N: IDC_MCX_Adapter (J2.2 J5.2), U_RLC_filter17 (L1_17.3 R5_17.2)
IN_N: IDC_MCX_Adapter (J2.5 J5.5), U_RLC_filter18 (L1_18.3 R5_18.2)
IN_N: IDC_MCX_Adapter (J2.8 J5.8), U_RLC_filter19 (L1_19.3 R5_19.2)
IN_N: IDC_MCX_Adapter (J2.11 J5.11), U_RLC_filter20 (L1_20.3 R5_20.2)
IN_N: IDC_MCX_Adapter (J2.14 J5.14), U_RLC_filter21 (L1_21.3 R5_21.2)
IN_N: IDC_MCX_Adapter (J2.17 J5.17), U_RLC_filter22 (L1_22.3 R5_22.2)
IN_N: IDC_MCX_Adapter (J2.20 J5.20), U_RLC_filter23 (L1_23.3 R5_23.2)
IN_N: IDC_MCX_Adapter (J2.23 J5.23), U_RLC_filter24 (L1_24.3 R5_24.2)
IN_N: IDC_MCX_Adapter (J7.2 J8.2), U_RLC_filter25 (L1_25.3 R5_25.2)
IN_N: IDC_MCX_Adapter (J7.5 J8.5), U_RLC_filter26 (L1_26.3 R5_26.2)
IN_N: IDC_MCX_Adapter (J7.8 J8.8), U_RLC_filter27 (L1_27.3 R5_27.2)
IN_N: IDC_MCX_Adapter (J7.11 J8.11), U_RLC_filter28 (L1_28.3 R5_28.2)
IN_N: IDC_MCX_Adapter (J7.14 J8.14), U_RLC_filter29 (L1_29.3 R5_29.2)
IN_N: IDC_MCX_Adapter (J7.17 J8.17), U_RLC_filter30 (L1_30.3 R5_30.2)
IN_N: IDC_MCX_Adapter (J7.20 J8.20), U_RLC_filter31 (L1_31.3 R5_31.2)
IN_N: IDC_MCX_Adapter (J7.23 J8.23), U_RLC_filter32 (L1_32.3 R5_32.2)
IN_P: IDC_MCX_Adapter (J3.1 J9.1), U_RLC_filter1 (L1_1.4 R1_1.2)
IN_P: IDC_MCX_Adapter (J3.4 J9.4), U_RLC_filter2 (L1_2.4 R1_2.2)
IN_P: IDC_MCX_Adapter (J3.7 J9.7), U_RLC_filter3 (L1_3.4 R1_3.2)
IN_P: IDC_MCX_Adapter (J3.10 J9.10), U_RLC_filter4 (L1_4.4 R1_4.2)
IN_P: IDC_MCX_Adapter (J3.13 J9.13), U_RLC_filter5 (L1_5.4 R1_5.2)
IN_P: IDC_MCX_Adapter (J3.16 J9.16), U_RLC_filter6 (L1_6.4 R1_6.2)
IN_P: IDC_MCX_Adapter (J3.19 J9.19), U_RLC_filter7 (L1_7.4 R1_7.2)
IN_P: IDC_MCX_Adapter (J3.22 J9.22), U_RLC_filter8 (L1_8.4 R1_8.2)
IN_P: IDC_MCX_Adapter (J4.1 J6.1), U_RLC_filter9 (L1_9.4 R1_9.2)
IN_P: IDC_MCX_Adapter (J4.4 J6.4), U_RLC_filter10 (L1_10.4 R1_10.2)
IN_P: IDC_MCX_Adapter (J4.7 J6.7), U_RLC_filter11 (L1_11.4 R1_11.2)
IN_P: IDC_MCX_Adapter (J4.10 J6.10), U_RLC_filter12 (L1_12.4 R1_12.2)
IN_P: IDC_MCX_Adapter (J4.13 J6.13), U_RLC_filter13 (L1_13.4 R1_13.2)
IN_P: IDC_MCX_Adapter (J4.16 J6.16), U_RLC_filter14 (L1_14.4 R1_14.2)
IN_P: IDC_MCX_Adapter (J4.19 J6.19), U_RLC_filter15 (L1_15.4 R1_15.2)
IN_P: IDC_MCX_Adapter (J4.22 J6.22), U_RLC_filter16 (L1_16.4 R1_16.2)
IN_P: IDC_MCX_Adapter (J2.1 J5.1), U_RLC_filter17 (L1_17.4 R1_17.2)
IN_P: IDC_MCX_Adapter (J2.4 J5.4), U_RLC_filter18 (L1_18.4 R1_18.2)
IN_P: IDC_MCX_Adapter (J2.7 J5.7), U_RLC_filter19 (L1_19.4 R1_19.2)
IN_P: IDC_MCX_Adapter (J2.10 J5.10), U_RLC_filter20 (L1_20.4 R1_20.2)
IN_P: IDC_MCX_Adapter (J2.13 J5.13), U_RLC_filter21 (L1_21.4 R1_21.2)
IN_P: IDC_MCX_Adapter (J2.16 J5.16), U_RLC_filter22 (L1_22.4 R1_22.2)
IN_P: IDC_MCX_Adapter (J2.19 J5.19), U_RLC_filter23 (L1_23.4 R1_23.2)
IN_P: IDC_MCX_Adapter (J2.22 J5.22), U_RLC_filter24 (L1_24.4 R1_24.2)
IN_P: IDC_MCX_Adapter (J7.1 J8.1), U_RLC_filter25 (L1_25.4 R1_25.2)
IN_P: IDC_MCX_Adapter (J7.4 J8.4), U_RLC_filter26 (L1_26.4 R1_26.2)
IN_P: IDC_MCX_Adapter (J7.7 J8.7), U_RLC_filter27 (L1_27.4 R1_27.2)
IN_P: IDC_MCX_Adapter (J7.10 J8.10), U_RLC_filter28 (L1_28.4 R1_28.2)
IN_P: IDC_MCX_Adapter (J7.13 J8.13), U_RLC_filter29 (L1_29.4 R1_29.2)
IN_P: IDC_MCX_Adapter (J7.16 J8.16), U_RLC_filter30 (L1_30.4 R1_30.2)
IN_P: IDC_MCX_Adapter (J7.19 J8.19), U_RLC_filter31 (L1_31.4 R1_31.2)
IN_P: IDC_MCX_Adapter (J7.22 J8.22), U_RLC_filter32 (L1_32.4 R1_32.2)
OUT_N: U_RLC_filter1 (C1_1.1 L1_1.2 R4_1.1 R5_1.1), Front_panel_FFC (J1.1)
OUT_N: U_RLC_filter2 (C1_2.1 L1_2.2 R4_2.1 R5_2.1), Front_panel_FFC (J1.3)
OUT_N: U_RLC_filter3 (C1_3.1 L1_3.2 R4_3.1 R5_3.1), Front_panel_FFC (J1.6)
OUT_N: U_RLC_filter4 (C1_4.1 L1_4.2 R4_4.1 R5_4.1), Front_panel_FFC (J1.8)
OUT_N: U_RLC_filter5 (C1_5.1 L1_5.2 R4_5.1 R5_5.1), Front_panel_FFC (J1.11)
OUT_N: U_RLC_filter6 (C1_6.1 L1_6.2 R4_6.1 R5_6.1), Front_panel_FFC (J1.13)
OUT_N: U_RLC_filter7 (C1_7.1 L1_7.2 R4_7.1 R5_7.1), Front_panel_FFC (J1.16)
OUT_N: U_RLC_filter8 (C1_8.1 L1_8.2 R4_8.1 R5_8.1), Front_panel_FFC (J1.18)
OUT_N: U_RLC_filter9 (C1_9.1 L1_9.2 R4_9.1 R5_9.1), Front_panel_FFC (J1.21)
OUT_N: U_RLC_filter10 (C1_10.1 L1_10.2 R4_10.1 R5_10.1), Front_panel_FFC (J1.23)
OUT_N: U_RLC_filter11 (C1_11.1 L1_11.2 R4_11.1 R5_11.1), Front_panel_FFC (J1.26)
OUT_N: U_RLC_filter12 (C1_12.1 L1_12.2 R4_12.1 R5_12.1), Front_panel_FFC (J1.28)
OUT_N: U_RLC_filter13 (C1_13.1 L1_13.2 R4_13.1 R5_13.1), Front_panel_FFC (J1.31)
OUT_N: U_RLC_filter14 (C1_14.1 L1_14.2 R4_14.1 R5_14.1), Front_panel_FFC (J1.33)
OUT_N: U_RLC_filter15 (C1_15.1 L1_15.2 R4_15.1 R5_15.1), Front_panel_FFC (J1.36)
OUT_N: U_RLC_filter16 (C1_16.1 L1_16.2 R4_16.1 R5_16.1), Front_panel_FFC (J1.38)
OUT_N: U_RLC_filter17 (C1_17.1 L1_17.2 R4_17.1 R5_17.1), Front_panel_FFC (J10.1)
OUT_N: U_RLC_filter18 (C1_18.1 L1_18.2 R4_18.1 R5_18.1), Front_panel_FFC (J10.3)
OUT_N: U_RLC_filter19 (C1_19.1 L1_19.2 R4_19.1 R5_19.1), Front_panel_FFC (J10.6)
OUT_N: U_RLC_filter20 (C1_20.1 L1_20.2 R4_20.1 R5_20.1), Front_panel_FFC (J10.8)
OUT_N: U_RLC_filter21 (C1_21.1 L1_21.2 R4_21.1 R5_21.1), Front_panel_FFC (J10.11)
OUT_N: U_RLC_filter22 (C1_22.1 L1_22.2 R4_22.1 R5_22.1), Front_panel_FFC (J10.13)
OUT_N: U_RLC_filter23 (C1_23.1 L1_23.2 R4_23.1 R5_23.1), Front_panel_FFC (J10.16)
OUT_N: U_RLC_filter24 (C1_24.1 L1_24.2 R4_24.1 R5_24.1), Front_panel_FFC (J10.18)
OUT_N: U_RLC_filter25 (C1_25.1 L1_25.2 R4_25.1 R5_25.1), Front_panel_FFC (J10.21)
OUT_N: U_RLC_filter26 (C1_26.1 L1_26.2 R4_26.1 R5_26.1), Front_panel_FFC (J10.23)
OUT_N: U_RLC_filter27 (C1_27.1 L1_27.2 R4_27.1 R5_27.1), Front_panel_FFC (J10.26)
OUT_N: U_RLC_filter28 (C1_28.1 L1_28.2 R4_28.1 R5_28.1), Front_panel_FFC (J10.28)
OUT_N: U_RLC_filter29 (C1_29.1 L1_29.2 R4_29.1 R5_29.1), Front_panel_FFC (J10.31)
OUT_N: U_RLC_filter30 (C1_30.1 L1_30.2 R4_30.1 R5_30.1), Front_panel_FFC (J10.33)
OUT_N: U_RLC_filter31 (C1_31.1 L1_31.2 R4_31.1 R5_31.1), Front_panel_FFC (J10.36)
OUT_N: U_RLC_filter32 (C1_32.1 L1_32.2 R4_32.1 R5_32.1), Front_panel_FFC (J10.38)
OUT_P: U_RLC_filter1 (R3_1.1), Front_panel_FFC (J1.2)
OUT_P: U_RLC_filter2 (R3_2.1), Front_panel_FFC (J1.4)
OUT_P: U_RLC_filter3 (R3_3.1), Front_panel_FFC (J1.7)
OUT_P: U_RLC_filter4 (R3_4.1), Front_panel_FFC (J1.9)
OUT_P: U_RLC_filter5 (R3_5.1), Front_panel_FFC (J1.12)
OUT_P: U_RLC_filter6 (R3_6.1), Front_panel_FFC (J1.14)
OUT_P: U_RLC_filter7 (R3_7.1), Front_panel_FFC (J1.17)
OUT_P: U_RLC_filter8 (R3_8.1), Front_panel_FFC (J1.19)
OUT_P: U_RLC_filter9 (R3_9.1), Front_panel_FFC (J1.22)
OUT_P: U_RLC_filter10 (R3_10.1), Front_panel_FFC (J1.24)
OUT_P: U_RLC_filter11 (R3_11.1), Front_panel_FFC (J1.27)
OUT_P: U_RLC_filter12 (R3_12.1), Front_panel_FFC (J1.29)
OUT_P: U_RLC_filter13 (R3_13.1), Front_panel_FFC (J1.32)
OUT_P: U_RLC_filter14 (R3_14.1), Front_panel_FFC (J1.34)
OUT_P: U_RLC_filter15 (R3_15.1), Front_panel_FFC (J1.37)
OUT_P: U_RLC_filter16 (R3_16.1), Front_panel_FFC (J1.39)
OUT_P: U_RLC_filter17 (R3_17.1), Front_panel_FFC (J10.2)
OUT_P: U_RLC_filter18 (R3_18.1), Front_panel_FFC (J10.4)
OUT_P: U_RLC_filter19 (R3_19.1), Front_panel_FFC (J10.7)
OUT_P: U_RLC_filter20 (R3_20.1), Front_panel_FFC (J10.9)
OUT_P: U_RLC_filter21 (R3_21.1), Front_panel_FFC (J10.12)
OUT_P: U_RLC_filter22 (R3_22.1), Front_panel_FFC (J10.14)
OUT_P: U_RLC_filter23 (R3_23.1), Front_panel_FFC (J10.17)
OUT_P: U_RLC_filter24 (R3_24.1), Front_panel_FFC (J10.19)
OUT_P: U_RLC_filter25 (R3_25.1), Front_panel_FFC (J10.22)
OUT_P: U_RLC_filter26 (R3_26.1), Front_panel_FFC (J10.24)
OUT_P: U_RLC_filter27 (R3_27.1), Front_panel_FFC (J10.27)
OUT_P: U_RLC_filter28 (R3_28.1), Front_panel_FFC (J10.29)
OUT_P: U_RLC_filter29 (R3_29.1), Front_panel_FFC (J10.32)
OUT_P: U_RLC_filter30 (R3_30.1), Front_panel_FFC (J10.34)
OUT_P: U_RLC_filter31 (R3_31.1), Front_panel_FFC (J10.37)
OUT_P: U_RLC_filter32 (R3_32.1), Front_panel_FFC (J10.39)